# Altium schematic sheet Power_Supply_Regulators.SchDoc
size A3; SheetNumber: 16; SheetTotal: 19
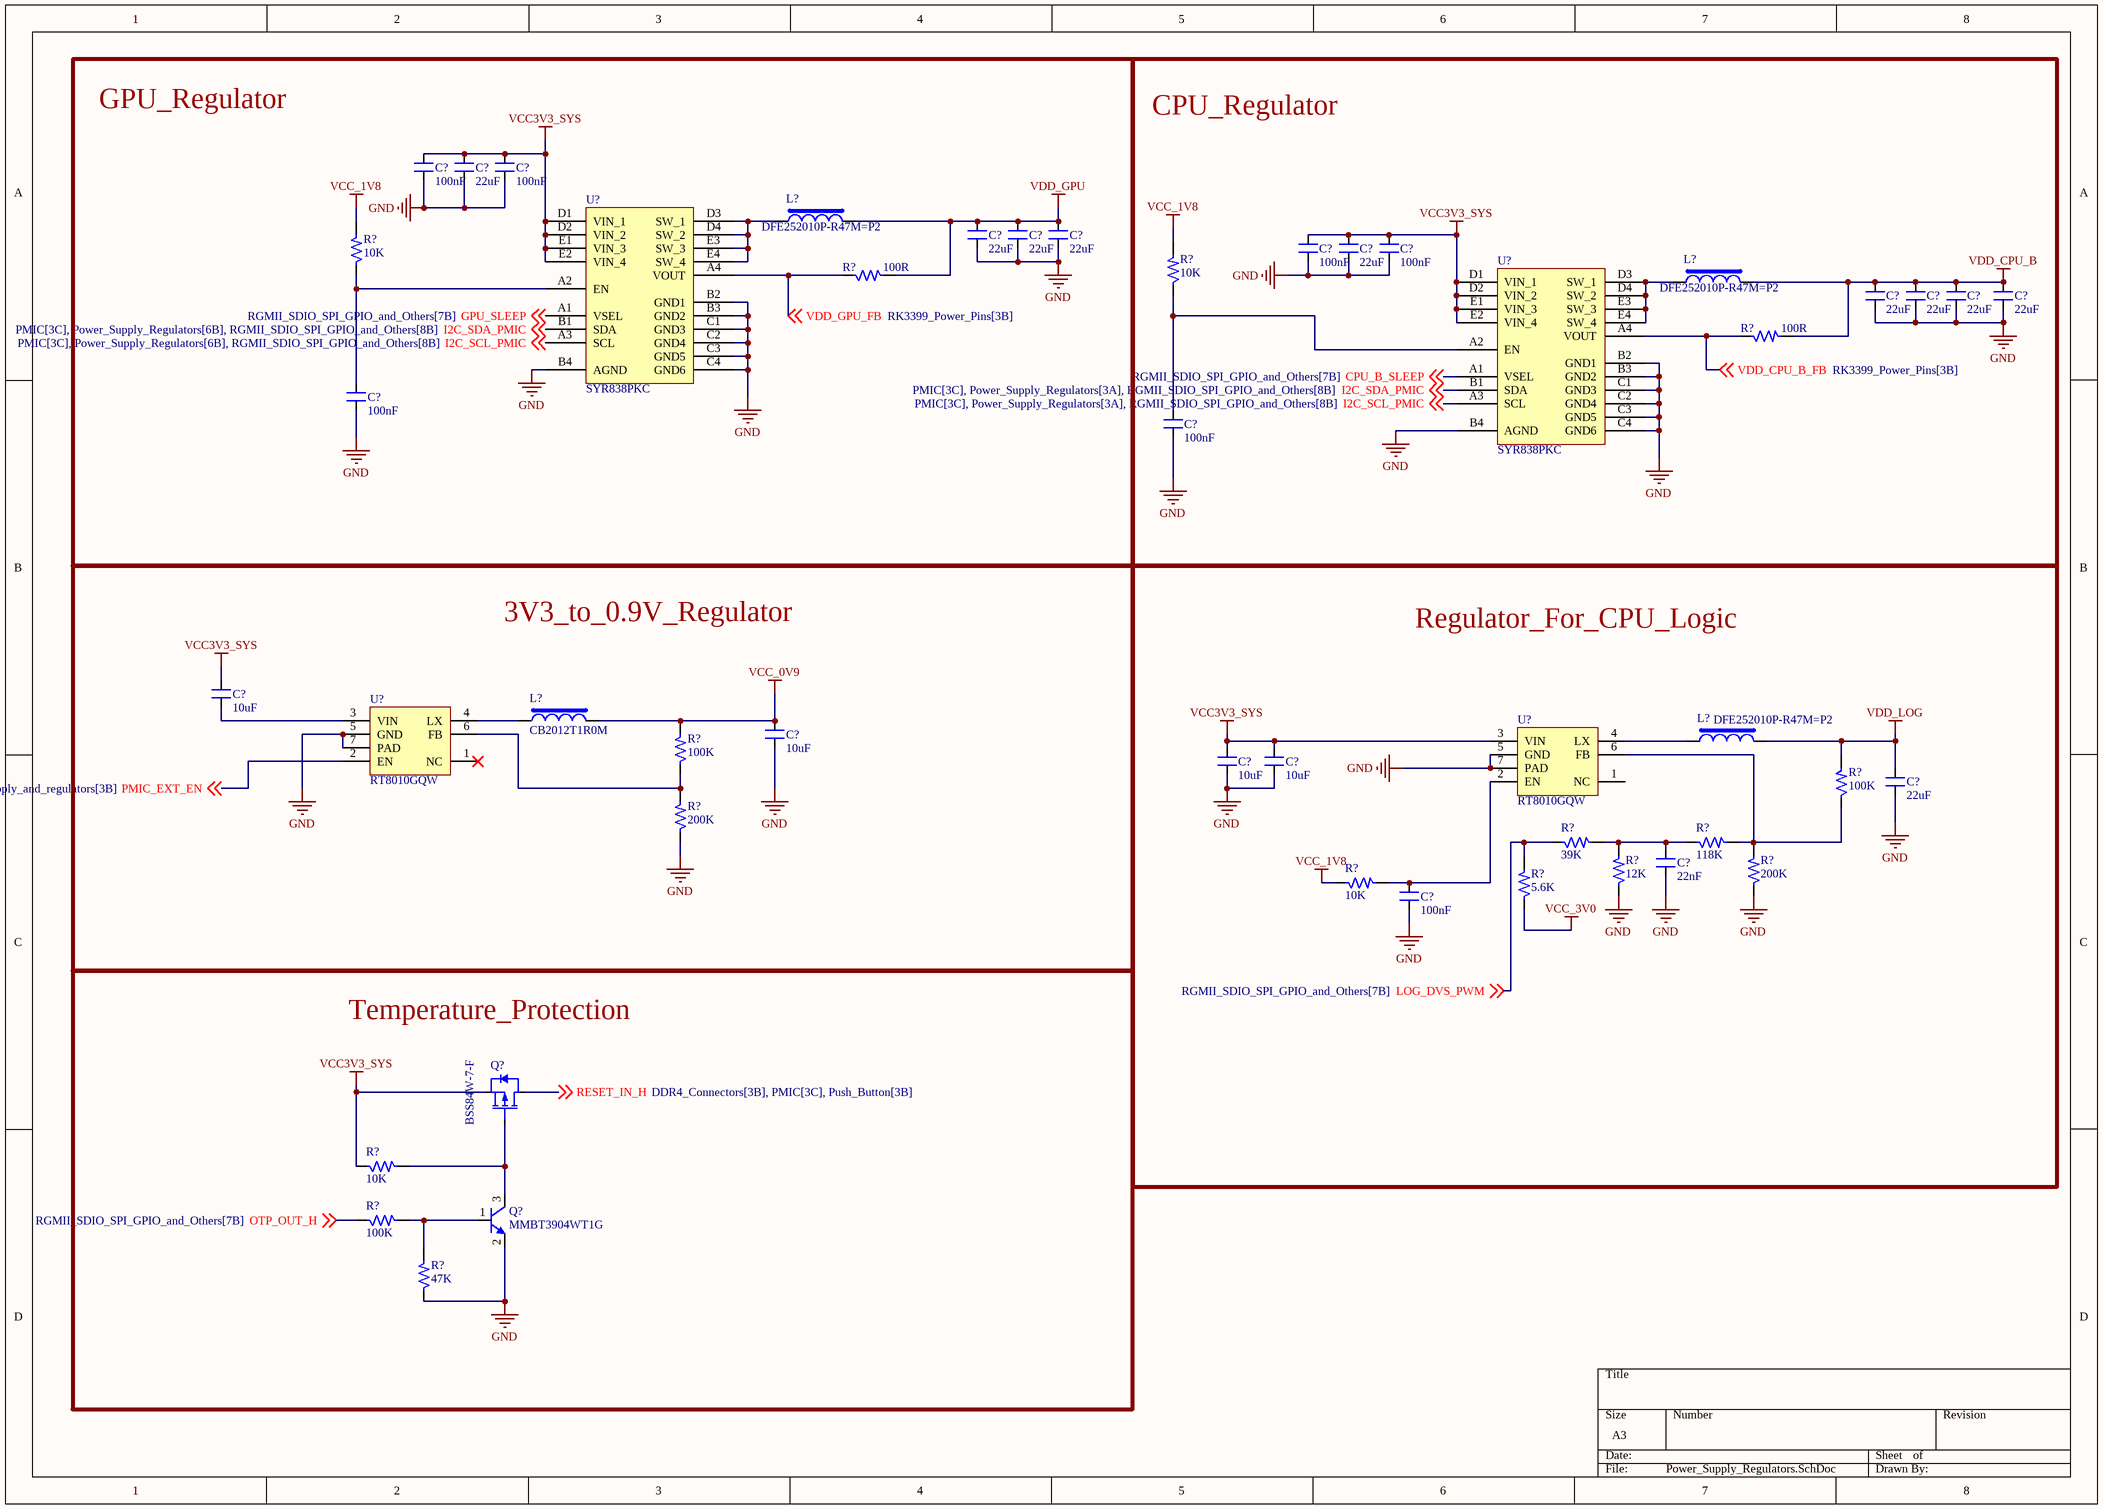
[diagram p0: Power_Supply_Regulators.SchDoc]

## Parts
(Parts that share a designator on the sheet are numbered #1, #2 ... from top to bottom, then left to right.)
C?#1  100nF  [CAP_0402]
C?#2  22uF  [CAP_0603]
C?#3  100nF  [CAP_0402]
C?#4  22uF  [CAP_0603]
C?#5  22uF  [CAP_0603]
C?#6  22uF  [CAP_0603]
C?#7  100nF  [CAP_0402]
C?#8  22uF  [CAP_0603]
C?#9  100nF  [CAP_0402]
C?#10  22uF  [CAP_0603]
C?#11  22uF  [CAP_0603]
C?#12  22uF  [CAP_0603]
C?#13  22uF  [CAP_0603]
C?#14  100nF  [CAP_0402]
C?#15  100nF  [CAP_0402]
C?#16  10uF  [CAP_0402]
C?#17  10uF  [CAP_0402]
C?#18  10uF  [CAP_0402]
C?#19  10uF  [CAP_0402]
C?#20  22uF  [CAP_0603]
C?#21  22nF  [CAP_0402]
C?#22  100nF  [CAP_0402]
L?#1  DFE252010P-R47M=P2  [IND_1008]
L?#2  DFE252010P-R47M=P2  [IND_1008]
L?#3  CB2012T1R0M  [IND_0805]
L?#4  DFE252010P-R47M=P2  [IND_1008]
Q?#1  BSS84W-7-F  [SOT-323-3]
Q?#2  MMBT3904WT1G  [SOT-323-3]
R?#1  10K  [RES_0402]
R?#2  100R  [RES_0402]
R?#3  10K  [RES_0402]
R?#4  100R  [RES_0402]
R?#5  100K  [RES_0402]
R?#6  100K  [RES_0402]
R?#7  200K  [RES_0402]
R?#8  39K  [RES_0402]
R?#9  118K  [RES_0402]
R?#10  10K  [RES_0402]
R?#11  12K  [RES_0402]
R?#12  200K  [RES_0402]
R?#13  5.6K  [RES_0402]
R?#14  10K  [RES_0402]
R?#15  100K  [RES_0402]
R?#16  47K  [RES_0402]
U?#1  SYR838PKC  [CSP20_15.7_100x84_SMD]
U?#2  SYR838PKC  [CSP20_15.7_100x84_SMD]
U?#3  RT8010GQW  [WDFN-6_26_133X100_SMD]
U?#4  RT8010GQW  [WDFN-6_26_133X100_SMD]

## Blocks framed on the sheet
GPU_Regulator: C?#1-C?#6 C?#14 L?#1 R?#1 R?#2 U?#1
CPU_Regulator: C?#7-C?#13 C?#15 L?#2 R?#3 R?#4 U?#2
3V3_to_0.9V_Regulator: C?#16 C?#17 L?#3 R?#5 R?#7 U?#3
Regulator_For_CPU_Logic: C?#18-C?#22 L?#4 R?#6 R?#8-R?#13 U?#4
Temperature_Protection: Q?#1 Q?#2 R?#14-R?#16

## Nets
GND: C?#1.1 C?#2.1 C?#3.1 C?#4.1 C?#5.1 C?#6.1 C?#7.1 C?#8.1 C?#9.1 C?#10.1 C?#11.1 C?#12.1 C?#13.1 C?#14.1 C?#15.1 C?#17.1 C?#18.1 C?#19.1 C?#20.1 C?#21.1 C?#22.1 Q?#2.2(E) R?#7.1 R?#11.1 R?#12.1 R?#16.1 U?#1.B2(GND1) U?#1.B3(GND2) U?#1.B4(AGND) U?#1.C1(GND3) U?#1.C2(GND4) U?#1.C3(GND5) U?#1.C4(GND6) U?#2.B2(GND1) U?#2.B3(GND2) U?#2.B4(AGND) U?#2.C1(GND3) U?#2.C2(GND4) U?#2.C3(GND5) U?#2.C4(GND6) U?#3.5(GND) U?#3.7(PAD) U?#4.5(GND) U?#4.7(PAD)
VCC3V3_SYS: C?#1.2 C?#2.2 C?#3.2 C?#7.2 C?#8.2 C?#9.2 C?#16.2 C?#18.2 C?#19.2 Q?#1.2(S) R?#14.1 U?#1.D1(VIN_1) U?#1.D2(VIN_2) U?#1.E1(VIN_3) U?#1.E2(VIN_4) U?#2.D1(VIN_1) U?#2.D2(VIN_2) U?#2.E1(VIN_3) U?#2.E2(VIN_4) U?#4.3(VIN)
VCC_0V9: C?#17.2 L?#3.2 R?#5.2
VCC_1V8: R?#1.2 R?#3.2 R?#10.1
VCC_3V0: R?#13.1
VDD_CPU_B: C?#10.2 C?#11.2 C?#12.2 C?#13.2 L?#2.2 R?#4.2
VDD_GPU: C?#4.2 C?#5.2 C?#6.2 L?#1.2 R?#2.2
VDD_LOG: C?#20.2 L?#4.2 R?#6.2
CPU_B_SLEEP: U?#2.A1(VSEL) ; off-sheet CPU_B_SLEEP
GPU_SLEEP: U?#1.A1(VSEL) ; off-sheet GPU_SLEEP
I2C_SCL_PMIC: U?#1.A3(SCL) U?#2.A3(SCL) ; off-sheet I2C_SCL_PMIC
I2C_SDA_PMIC: U?#1.B1(SDA) U?#2.B1(SDA) ; off-sheet I2C_SDA_PMIC
LOG_DVS_PWM: R?#8.1 R?#13.2 ; off-sheet LOG_DVS_PWM
OTP_OUT_H: R?#15.1 ; off-sheet OTP_OUT_H
PMIC_EXT_EN: U?#3.2(EN) ; off-sheet PMIC_EXT_EN
RESET_IN_H: Q?#1.3(D) ; off-sheet RESET_IN_H
VDD_CPU_B_FB: R?#4.1 U?#2.A4(VOUT) ; off-sheet VDD_CPU_B_FB
VDD_GPU_FB: R?#2.1 U?#1.A4(VOUT) ; off-sheet VDD_GPU_FB
NetC?#14_2: C?#14.2 R?#1.1 U?#1.A2(EN)
NetC?#15_2: C?#15.2 R?#3.1 U?#2.A2(EN)
NetC?#16_1: C?#16.1 U?#3.3(VIN)
NetC?#21_2: C?#21.2 R?#8.2 R?#9.1 R?#11.2
NetC?#22_2: C?#22.2 R?#10.2 U?#4.2(EN)
NetL?#1_1: L?#1.1 U?#1.D3(SW_1) U?#1.D4(SW_2) U?#1.E3(SW_3) U?#1.E4(SW_4)
NetL?#2_1: L?#2.1 U?#2.D3(SW_1) U?#2.D4(SW_2) U?#2.E3(SW_3) U?#2.E4(SW_4)
NetL?#3_1: L?#3.1 U?#3.4(LX)
NetL?#4_1: L?#4.1 U?#4.4(LX)
NetQ?#1_1: Q?#1.1(G) Q?#2.3(C) R?#14.2
NetQ?#2_1: Q?#2.1(B) R?#15.2 R?#16.2
NetR?#5_1: R?#5.1 R?#7.2 U?#3.6(FB)
NetR?#6_1: R?#6.1 R?#9.2 R?#12.2 U?#4.6(FB)

Not connected (* = marked no-connect by the designer): U?#3 1(NC)*; U?#4 1(NC)

## Library data of the parts
C?#1 C?#3 C?#7 C?#9 C?#14 C?#15 C?#22 = CAP_100nF-25V-10%-0402: 0.1µF ±10% 25V Ceramic Capacitor X7R 0402 (1005 Metric); Manufacturer: Walsin Technology Corporation; Manufacturer Part Number: 0402B104K250CT; Case/Package: 0402; Supplier-1: Digikey
C?#2 C?#4-C?#6 C?#8 C?#10-C?#13 C?#20 = CAP_22uF-10V-20%-0603: 22µF ±20% 10V Ceramic Capacitor X5R 0603 (1608 Metric); Manufacturer: Murata Electronics; Manufacturer Part Number: GRM188R61A226ME15D; Case/Package: 0603; Supplier-1: Digikey
C?#16-C?#19 = CAP_10uF-10V-20%-0402: 10µF ±20% 10V Ceramic Capacitor X5R 0402 (1005 Metric); Manufacturer Part Number: CL05A106MP5NUNC; Manufacturer: Samsung Electro-Mechanics; Case/Package: 0402; Supplier-1: Digikey
C?#21 = CAP_22nF-10V-10%-0402: 0.022µF ±10% 10V Ceramic Capacitor X7R 0402 (1005 Metric); Manufacturer: Samsung Electro-Mechanics; Manufacturer Part Number: CL05B223KP5NNNC; Case/Package: 0402; Supplier-1: Digikey
L?#1 L?#2 L?#4 = IND_470nH-5A-20%-1008: 470nH Shielded Wirewound Inductor 5A 35mOhm Max 1008 (2520 Metric); Manufacturer: Murata Electronics; Manufacturer Part Number: DFE252010P-R47M=P2; Case/Package: 1008; Supplier-1: Digikey
L?#3 = IND_1uF-0.5A-20%-0805: 1uH ±20% 500mA 150mΩ 0805 Inductors (SMD) RoHS; Manufacturer: Taiyo Yuden; Manufacturer Part Number: CB2012T1R0M; Case/Package: 0805; Supplier-1: LCSC
Q?#1 = MOSFET-P_50V-130mA-SOT-323: P-Channel 50V 130mA (Ta) 200mW (Ta) Surface Mount SOT-323; Manufacturer: Diodes Incorporated; Manufacturer Part Number: BSS84W-7-F; Case/Package: SOT-323; Supplier-1: Digikey
Q?#2 = TRNS-NPN_60V-0.2A-SOT323: Bipolar Transistors - BJT 200mA 60V NPN; Manufacturer: ON Semiconductor; Manufacturer Part Number: MMBT3904WT1G; Case/Package: SOT323; Supplier-1: Digikey
R?#1 R?#3 R?#10 R?#14 = RES_10K-0.1W-1%-0402: 10 kOhms ±1% 0.1W, 1/10W Chip Resistor 0402 (1005 Metric) Anti-Sulfur Thin Film; Manufacturer: Vishay Beyschlag/Draloric/BC Components; Manufacturer Part Number: MCS04020C1002FE000; Case/Package: 0402; Supplier-1: Digikey
R?#2 R?#4 = RES_100R-0.1W-1%-0402: 100 Ohms ±1% 0.1W, 1/10W Chip Resistor 0402 (1005 Metric) Automotive AEC-Q200, Moisture Resistant Thick Film; Manufacturer: KOA Speer Electronics, Inc.; Manufacturer Part Number: RK73H1ETTP1000F; Case/Package: 0402; Supplier-1: Digikey
R?#5 R?#6 R?#15 = RES_100K-0.1W-1%-0402: 100 kOhms ±1% 0.1W, 1/10W Chip Resistor 0402 (1005 Metric) Anti-Sulfur Thin Film; Manufacturer: Vishay Beyschlag/Draloric/BC Components; Manufacturer Part Number: MCS04020C1003FE000; Case/Package: 0402; Supplier-1: Digikey
R?#7 R?#12 = RES_200K-0.1W-1%-0402: 200 kOhms ±1% 0.1W, 1/10W Chip Resistor 0402 (1005 Metric) Automotive AEC-Q200 Thick Film; Manufacturer: Panasonic Electronic Components; Manufacturer Part number: ERJ-2RKF2003X; Case/Package: 0402; Supplier-1: Digikey
R?#8 = RES_39K-0.1W-1%-0402: 39 kOhms ±1% 0.1W, 1/10W Chip Resistor 0402 (1005 Metric) Automotive AEC-Q200, Moisture Resistant Thick Film; Manufacturer: KOA Speer Electronics, Inc.; Manufacturer Part Number: RK73H1ETTP3902F; Case/Package: 0402; Supplier-1: Digikey
R?#9 = RES_118K-0.1W-1%-0402: 118 kOhms ±1% 0.1W, 1/10W Chip Resistor 0402 (1005 Metric) Automotive AEC-Q200, Moisture Resistant Thick Film; Manufacturer: KOA Speer Electronics, Inc.; Manuafcturer Part Number: RK73H1ETTP1183F; Case/Package: 0402; Supplier-1: Digikey
R?#11 = RES_12K-0.1W-1%-0402: 12 kOhms ±1% 0.1W, 1/10W Chip Resistor 0402 (1005 Metric) Anti-Sulfur Thin Film; Manufacturer: Vishay Beyschlag/Draloric/BC Components; Manufacturer Part Number: MCS04020C1202FE000; Case/Package: 0402; Supplier-1: Digikey
R?#13 = RES_5.6K-0.1W-1%-0402: 5.6 kOhms ±1% 0.1W, 1/10W Chip Resistor 0402 (1005 Metric) Automotive AEC-Q200, Moisture Resistant Thick Film; Manufacturer: KOA Speer Electronics, Inc.; Manufacturer Part Number: RK73H1ETTP5601F; Case/Package: 0402; Supplier-1: Digikey
R?#16 = RES_47K-0.1W-1%-0402: 47 kOhms ±1% 0.1W, 1/10W Chip Resistor 0402 (1005 Metric) Automotive AEC-Q200 Thick Film; Manufacturer: Panasonic Electronic Components; Manufacturer Part Number: ERJ-2RKF4702X; Case/Package: 0402; Supplier-1: Digikey
U?#1 U?#2 = IC_SYR838PKC: Step-Down Positive Programmable 1 6A 2.4MHz CSP1.56*1.96-20 DC-DC Converters RoHS; Manufacturer: Silergy Corp; Manufacturer Part Number: SYR838PKC; Case/Package: CSP1.56*1.96-20; Supplier-1: LCSC
U?#3 U?#4 = REG-ADJ_5.5V-5.5V-1A-6-WDFN: Buck Switching Regulator IC Positive Adjustable 0.6V 1 Output 1A 6-WDFN Exposed Pad; Manufacturer: Richtek USA Inc.; Manufacturer Part Number: RT8010GQW; Case/Package: 6-WDFN; Supplier-1: Digikey